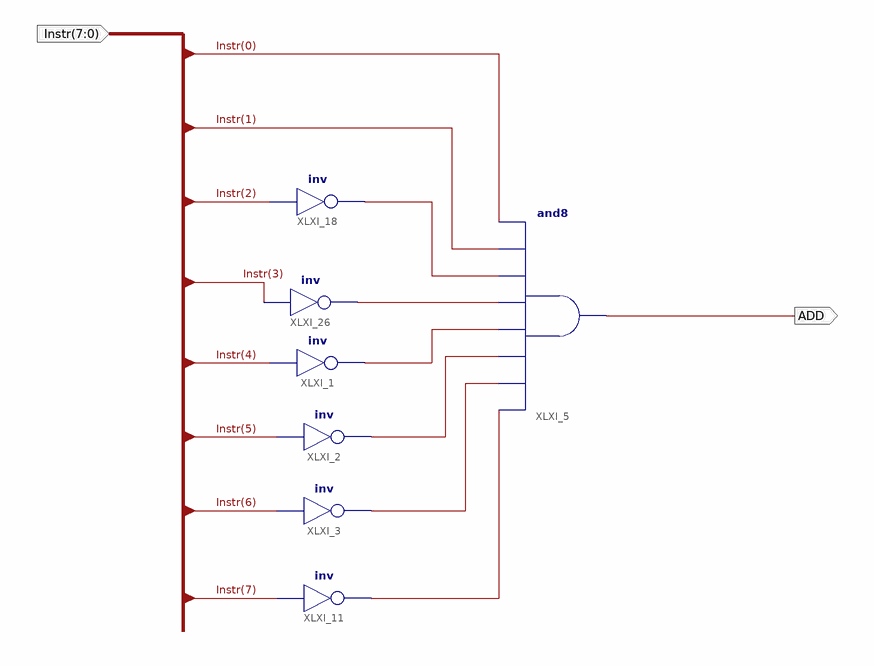
[diagram p0: schematic sheet 1]
// Xilinx ISE schematic instrADD.sch (spartan3e) as structural Verilog: 7 symbols, 2 ports
module instrADD (
  input  [7:0] Instr,
  output ADD
);

  wire XLXN_2, XLXN_3, XLXN_4, XLXN_5, XLXN_15, XLXN_16;

  not XLXI_1 (XLXN_2, Instr[4]);
  not XLXI_2 (XLXN_3, Instr[5]);
  not XLXI_3 (XLXN_4, Instr[6]);
  not XLXI_11 (XLXN_5, Instr[7]);
  and XLXI_5 (ADD, XLXN_5, XLXN_4, XLXN_3, XLXN_2, XLXN_16, XLXN_15, Instr[1], Instr[0]);
  not XLXI_18 (XLXN_15, Instr[2]);
  not XLXI_26 (XLXN_16, Instr[3]);
endmodule
